# EAGLE design can-switch (EAGLE 4.16)
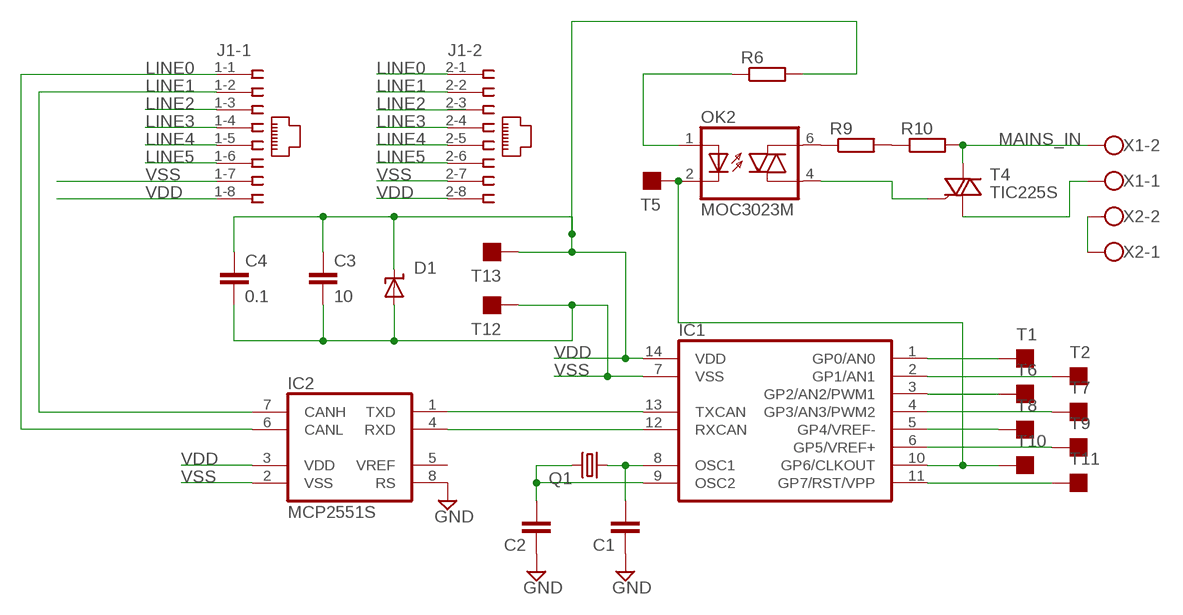
[diagram p0: schematic, sheet 1]

## Parts
C1  C-EUC0805  [C0805]
C2  C-EUC0805  [C0805]
C3  10  C-EUC1812  [C1812]
C4  0.1  C-EUC1206  [C1206]
D1  SUPPRESSOR-SMBJ  [SMBJ]
IC1  MCP25050SL  [SO14]
IC2  MCP2551S  [SO08]
J1  557560-1  [557560-1]
OK2  MOC3023M  [DIL06]
Q1  CRYSTALHC49S  [HC49/S]
R6  R-EU_R0805  [R0805]
R9  R-EU_R1206  [R1206]
R10  R-EU_R1206  [R1206]
T1  TESTPOINT  [TESTPOIN]
T2  TESTPOINT  [TESTPOIN]
T4  TIC225S  [TO220DS]
T5  TESTPOINT  [TESTPOIN]
T6  TESTPOINT  [TESTPOIN]
T7  TESTPOINT  [TESTPOIN]
T8  TESTPOINT  [TESTPOIN]
T9  TESTPOINT  [TESTPOIN]
T10  TESTPOINT  [TESTPOIN]
T11  TESTPOINT  [TESTPOIN]
T12  TESTPOINT  [TESTPOIN]
T13  TESTPOINT  [TESTPOIN]
X1  W237-02P  [W237-132]
X2  W237-02P  [W237-132]

## Nets
GND: C1.1 C2.1 IC2.8(RS)
LINE0: IC2.6(CANL) J1.1-1 J1.2-1
LINE1: IC2.7(CANH) J1.1-2 J1.2-2
LINE2: J1.1-3 J1.2-3
LINE3: J1.1-4 J1.2-4
LINE4: J1.1-5 J1.2-5
LINE5: J1.1-6 J1.2-6
MAINS_IN: R10.2 T4.A2 X1.2
N$1: C2.2 IC1.9(OSC2) Q1.2
N$2: C1.2 IC1.8(OSC1) Q1.1
N$3: IC1.13(TXCAN) IC2.1(TXD)
N$4: IC1.12(RXCAN) IC2.4(RXD)
N$6: T4.A1 X1.1
N$7: OK2.6(A2) R9.1
N$8: IC1.1(GP0/AN0) T1.1
N$9: OK2.4(A1) T4.G
N$10: IC1.2(GP1/AN1) T2.1
N$11: IC1.3(GP2/AN2/PWM1) T6.1
N$12: IC1.4(GP3/AN3/PWM2) T7.1
N$13: IC1.5(GP4/VREF-) T8.1
N$14: IC1.6(GP5/VREF+) T9.1
N$15: IC1.10(GP6/CLKOUT) OK2.2(C) T5.1 T10.1
N$16: R9.2 R10.1
N$17: IC1.11(GP7/RST/VPP) T11.1
N$18: X2.1 X2.2
N$24: OK2.1(A) R6.1
VDD: C3.1 C4.1 D1.C IC1.14(VDD) IC2.3(VDD) J1.1-8 J1.2-8 R6.2 T13.1
VSS: C3.2 C4.2 D1.A IC1.7(VSS) IC2.2(VSS) J1.1-7 J1.2-7 T12.1
Unconnected: IC2.5(VREF)

## Library data of the parts
C1-C4 = rcl:C-EU: CAPACITOR, European symbol
D1 = diode:SUPPRESSOR-: Suppressor diode
IC1 = my:MCP25050
IC2 = my:MCP2551
J1 = con-amp:557560-1: AMP connector
OK2 = optocoupler:MOC30*M: RANDOM-PHASE OPTOISOLATORS TRIAC DRIVER OUTPUT Source: http://www.fairchildsemi.com MOC3020-M.pdf
Q1 = crystal:CRYSTAL: CRYSTAL
R6 R9 R10 = rcl:R-EU_: RESISTOR, European symbol
T1 T2 T5-T13 = ads4:TESTPOINT: Test point
T4 = triac:TIC225S: TRIAC
X1 X2 = con-wago-508:W237-02P: WAGO SREW CLAMP

## Board
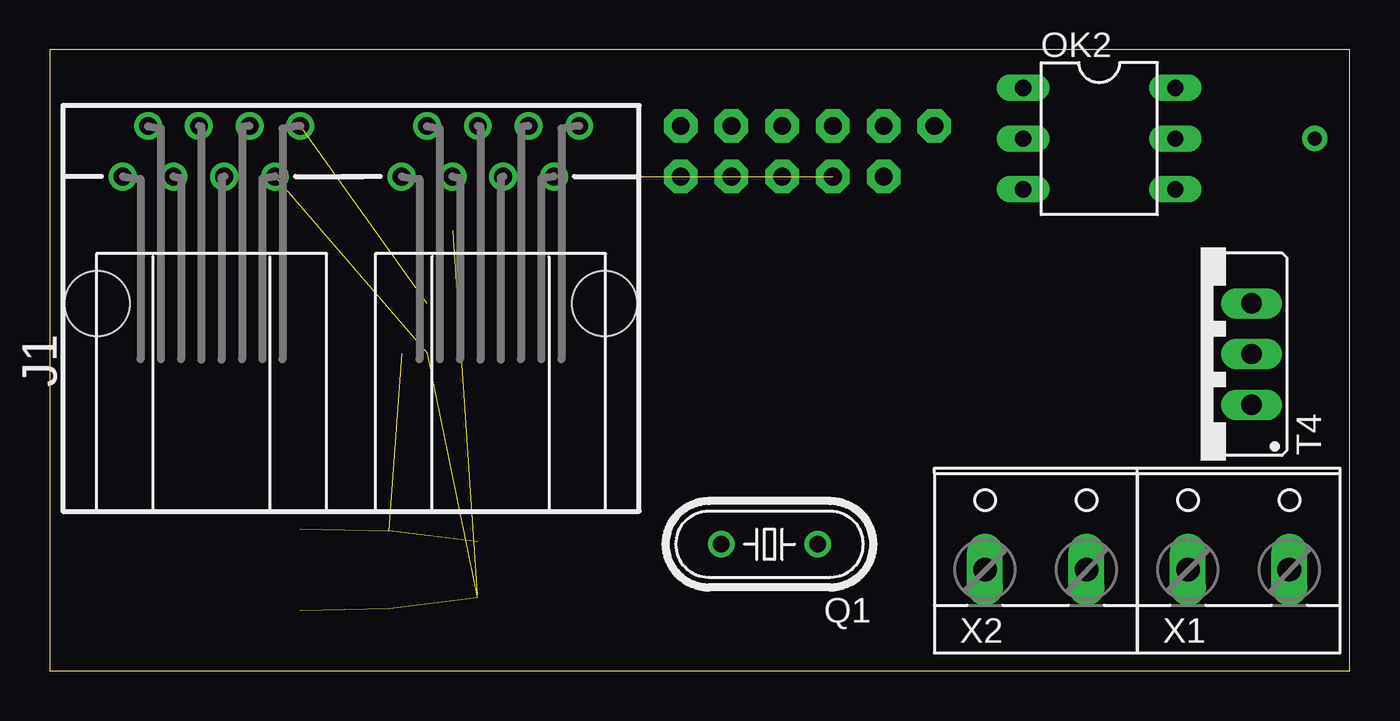
[diagram p1: board, top side]
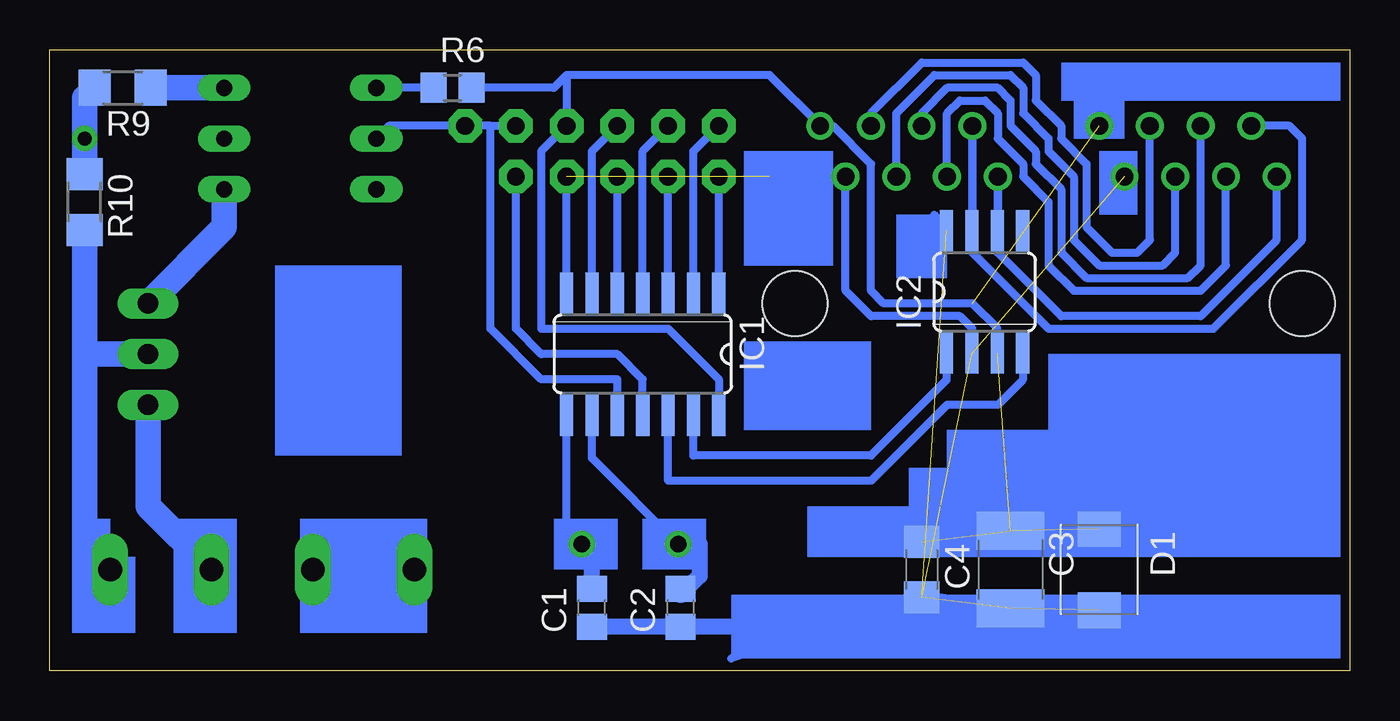
[diagram p2: board, bottom side, seen from below]

Size 65.07 x 31.11 mm. Coordinates in mm from the lower left corner, seen from the top.
Outline: 0,0 65.07,0 65.07,31.11 0,31.11 0,0
Copper layers (1*16): Top 0.035mm / dielectric 1.5mm / Bottom 0.035mm
Design rules "default": minimum track width 10mil, minimum drill 24mil, track to track 8mil, track to pad 8mil, pad to pad 8mil, via to via 8mil, smd to smd 8mil, copper to edge 40mil, drill to drill 8mil, minimum pad ring 10mil, minimum via ring 8mil, stop-mask expansion 4mil, vias tented up to drill 0mil, thermal gap 10mil

### Footprints (pad centres in the part's own frame; a part is rotated, then mirrored left to right if it is on the bottom)
C0805 = smd 1.3 x 1.5: 1 -0.95,0; 2 0.95,0
C1812 = smd 1.9 x 3.4: 1 -1.95,0; 2 1.95,0
C1206 = smd 1.6 x 1.8: 1 -1.4,0; 2 1.4,0
SMBJ = smd 1.78 x 2.16: A 2.04,0; C -2.03,0
SO14 = smd 0.66 x 2.032: 1 -3.81,-3.073; 2 -2.54,-3.073; 3 -1.27,-3.073; 4 0,-3.073; 5 1.27,-3.073; 6 2.54,-3.073; 7 3.81,-3.073; 8 3.81,3.073; 9 2.54,3.073; 10 1.27,3.073; 11 0,3.073; 12 -1.27,3.073; 13 -2.54,3.073; 14 -3.81,3.073
SO08 = smd 0.66 x 2.032: 1 -1.905,-3.073; 2 -0.635,-3.073; 3 0.635,-3.073; 4 1.905,-3.073; 5 1.905,3.073; 6 0.635,3.073; 7 -0.635,3.073; 8 -1.905,3.073
557560-1 = drill 0.889 round: 1-1 -11.43,6.35; 1-2 -10.16,8.89; 1-3 -8.89,6.35; 1-4 -7.62,8.89; 1-5 -6.35,6.35; 1-6 -5.08,8.89; 1-7 -3.81,6.35; 1-8 -2.54,8.89; 2-1 2.54,6.35; 2-2 3.81,8.89; 2-3 5.08,6.35; 2-4 6.35,8.89; 2-5 7.62,6.35; 2-6 8.89,8.89; 2-7 10.16,6.35; 2-8 11.43,8.89 | hole 3.251: -12.7,0; 12.7,0
DIL06 = drill 0.813 long: 1 -2.54,-3.81; 2 0,-3.81; 3 2.54,-3.81; 4 2.54,3.81; 5 0,3.81; 6 -2.54,3.81
HC49/S = drill 0.813 round: 1 -2.413,0; 2 2.413,0
R0805 = smd 1.3 x 1.5: 1 -0.95,0; 2 0.95,0
R1206 = smd 1.6 x 1.8: 1 -1.4,0; 2 1.4,0
TESTPOIN = drill 0.889 pad 1.676 octagon: 1 0,0
TO220DS = drill 1.016 long: A1 -2.54,-2.54; A2 0,-2.54; G 2.54,-2.54
W237-132 = drill 1.194 long: 1 -2.54,-0.635; 2 2.54,-0.635

### Placement (x,y rotation side)
C1  37.94,3.17 90 bottom
C2  33.49,3.17 90 bottom
C3  16.98,5.08 270 bottom
C4  21.43,5.08 270 bottom
D1  12.54,5.08 270 bottom
IC1  35.4,15.87 180 bottom
IC2  18.28,18.98 0 bottom
J1  15.08,18.41 0 top
OK2  52.54,26.67 270 top
Q1  36.03,6.34 180 top
R6  44.92,29.21 0 bottom
R9  61.43,29.21 180 bottom
R10  63.34,23.49 270 bottom
T1  31.59,24.76 0 top
T2  31.59,27.3 0 top
T4  57.62,15.87 90 top
T5  44.29,27.3 0 top
T6  34.12,24.76 0 top
T7  34.12,27.3 0 top
T8  36.66,24.76 0 top
T9  36.66,27.3 0 top
T10  41.74,27.3 0 top
T11  41.74,24.76 0 top
T12  39.2,24.76 0 top
T13  39.2,27.3 0 top
X1  59.52,5.71 0 top
X2  49.37,5.71 0 top

### Tracks (layer width: path | path; a pad name or v marks a point on that pad's centre or on a via)
GND  (1 unrouted)
  Bottom 0.406: C2.1 34.12,2.54 | 30.95,0.63 29.05,1.27 21.43,3.81 16.98,3.17 | IC2.8 20.79,22.86
  Bottom 0.813: 33.49,2.25 33.48,2.25 | 33.49,2.25 C2.1 | 33.52,2.22 C1.1 | 33.52,2.22 33.49,2.25 | 33.52,2.22 30,2.22 29.05,1.27
LINE0
  Bottom 0.406: IC2.6 17.62,22.05 J1.2-1 17.62,20.95 14.44,17.78 7.46,17.78 3.65,21.59 J1.1-1
LINE1
  Bottom 0.406: IC2.7 18.89,22.05 J1.2-2 18.89,20.95 15.08,17.14 6.82,17.14 2.38,21.59 2.38,26.67 3.01,27.3 J1.1-2
LINE2
  Bottom 0.406: J1.2-3 20.16,27.94 19.52,28.57 18.25,28.57 17.62,27.94 17.62,26.67 16.35,25.39 16.35,24.76 15.08,23.49 15.08,20.32 13.81,19.05 7.46,19.05 6.18,20.32 J1.1-3
LINE3
  Bottom 0.406: J1.2-4 21.43,27.94 20.16,29.21 17.62,29.21 16.98,28.57 16.98,27.3 15.71,26.03 15.71,25.39 14.44,24.12 14.44,20.95 13.17,19.68 8.09,19.68 7.46,20.32 J1.1-4
LINE4
  Bottom 0.406: J1.2-5 22.7,27.94 20.79,29.84 16.98,29.84 16.35,29.21 16.35,27.94 15.08,26.67 15.08,26.03 13.81,24.76 13.81,21.59 12.54,20.32 9.36,20.32 8.73,20.95 J1.1-5
LINE5
  Bottom 0.406: J1.2-6 23.96,27.94 21.43,30.48 16.35,30.48 15.71,29.84 15.71,28.57 14.44,27.3 14.44,26.67 13.17,25.39 13.17,22.22 11.9,20.95 10.63,20.95 10,21.59 J1.1-6
MAINS_IN
  Bottom 1.27: T4.A2 63.34,15.87 R10.2 63.34,6.98 62.06,5.71 X1.2
N$1
  Bottom 0.406: 32.54,6.34 Q1.2 37.94,10.66 IC1.9
  Bottom 0.813: C2.2 33.49,3.81 32.54,4.75 32.54,6.34
N$2
  Bottom 0.406: 38.88,6.34 38.57,6.34 39.2,6.34 IC1.8
  Bottom 0.813: Q1.1 38.57,6.34 37.94,5.71 C1.2
N$3
  Bottom 0.406: IC2.1 20.18,14.57 23.96,10.79 32.86,10.79 IC1.13 | IC1.13 32.86,13.22 | IC1.13 32.86,13.02 32.95,13.12 32.86,13.22 | 32.86,13.33 32.86,13.22
N$4
  Bottom 0.406: IC2.4 16.37,14.57 17.62,13.33 20.16,13.33 23.96,9.52 34.12,9.52 34.12,12.83 | 34.12,12.83 IC1.12 | 34.12,12.83 34.06,12.89
N$6
  Bottom 1.27: X1.1 60.16,8.25 T4.A1
N$7
  Bottom 1.27: OK2.6 R9.1
N$8
  Bottom 0.406: IC1.1 T1.1
N$9
  Bottom 1.27: T4.G 56.35,22.22 OK2.4
N$10
  Bottom 0.406: IC1.2 32.86,26.03 T2.1
N$11
  Bottom 0.406: IC1.3 T6.1
N$12
  Bottom 0.406: IC1.4 35.4,26.03 T7.1
N$13
  Bottom 0.406: IC1.5 T8.1
N$14
  Bottom 0.406: IC1.6 37.94,26.03 T9.1
N$15
  Bottom 0.406: IC1.10 36.66,14.6 40.48,14.6 43.02,17.14 43.02,27.3 | OK2.2 48.09,27.3 T5.1 43.02,27.3 | 43.02,27.3 T10.1
N$16
  Bottom 0.813: 63.34,24.76 R10.1 | R9.2 63.34,28.7
  Bottom 1.27: 63.34,28.7 R10.1
N$17
  Bottom 0.406: IC1.11 35.4,14.6 36.66,15.87 40.48,15.87 41.74,17.14 T11.1
N$18
  Bottom 1.27: X2.2 X2.1
N$19  (via drill 0.7 pad 1.27)
  other vias: 63.34,26.67
N$24
  Bottom 0.406: R6.1 OK2.1
VDD  (4 unrouted)
  Bottom 0.406: J1.2-8 26.23,27.3 | IC1.14 31.59,14.6 34.12,17.14 40.48,17.14 40.48,26.03 T13.1 39.2,29.84 | IC2.3 17.64,17.17 18.89,18.41 23.33,18.41 23.96,19.05 23.96,25.39 25.87,27.3 J1.2-8 | J1.2-8 29.05,29.84 39.2,29.84 | 39.2,29.84 39.84,29.21 R6.2
VSS  (5 unrouted)
  Bottom 0.406: IC2.2 18.91,17.17 19.52,17.78 23.96,17.78 25.23,19.05 J1.2-7 | IC1.7 T12.1
  Bottom 0.61: J1.2-7 29.05,24.76
(copper drawn outside any net)
  shapes: Bottom area x18